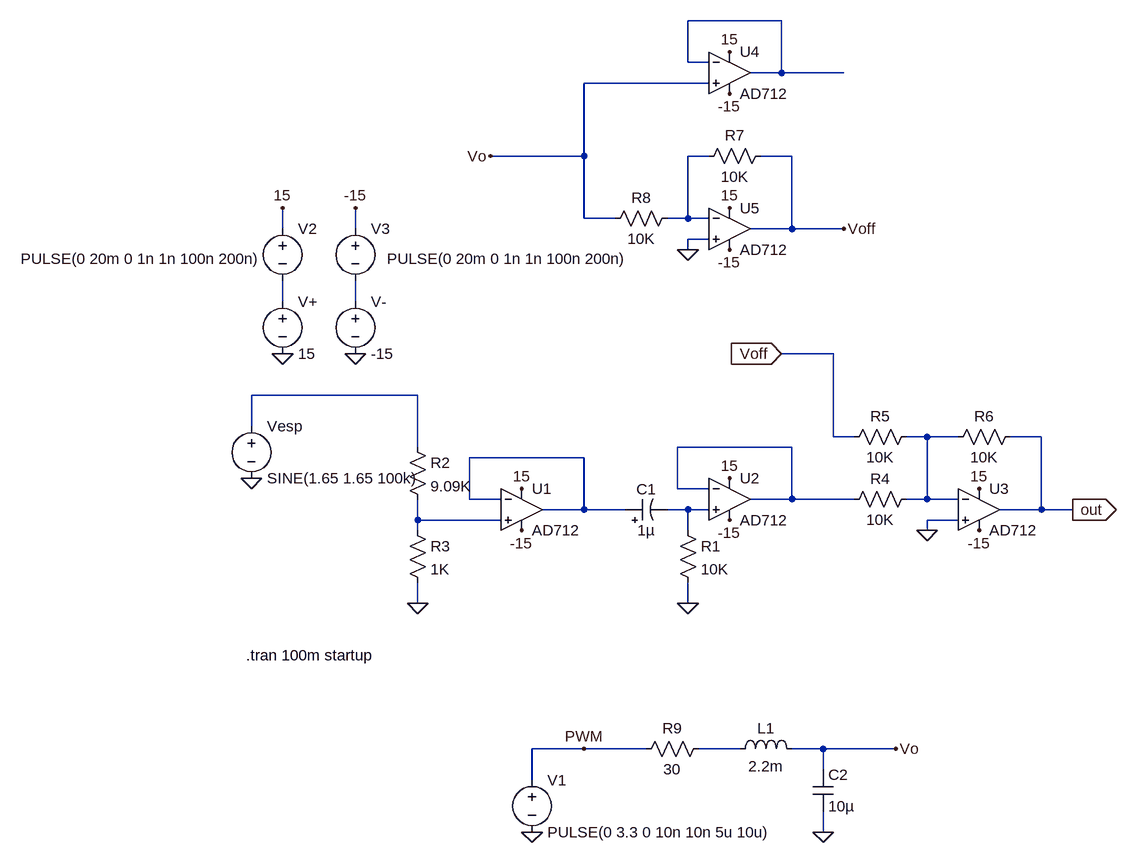
[diagram p0: schematic other.asc]
other.asc, the LTspice schematic file:
Version 4.1
SHEET 1 880 864
WIRE -368 -592 -512 -592
WIRE -512 -528 -512 -592
WIRE -480 -528 -512 -528
WIRE -368 -512 -368 -592
WIRE -368 -512 -416 -512
WIRE -272 -512 -368 -512
WIRE -480 -496 -672 -496
WIRE -672 -384 -672 -496
WIRE -672 -384 -816 -384
WIRE -480 -384 -512 -384
WIRE -352 -384 -400 -384
WIRE -672 -288 -672 -384
WIRE -624 -288 -672 -288
WIRE -512 -288 -512 -384
WIRE -512 -288 -544 -288
WIRE -480 -288 -512 -288
WIRE -1136 -272 -1136 -304
WIRE -1024 -272 -1024 -304
WIRE -352 -272 -352 -384
WIRE -352 -272 -416 -272
WIRE -272 -272 -352 -272
WIRE -480 -256 -512 -256
WIRE -512 -240 -512 -256
WIRE -1136 -160 -1136 -192
WIRE -1024 -160 -1024 -192
WIRE -288 -80 -368 -80
WIRE -928 -16 -1184 -16
WIRE -1184 32 -1184 -16
WIRE -288 48 -288 -80
WIRE -256 48 -288 48
WIRE -144 48 -176 48
WIRE -96 48 -144 48
WIRE 32 48 -16 48
WIRE -928 64 -928 -16
WIRE -352 64 -528 64
WIRE -672 80 -848 80
WIRE -528 128 -528 64
WIRE -480 128 -528 128
WIRE -848 144 -848 80
WIRE -800 144 -848 144
WIRE -352 144 -352 64
WIRE -352 144 -416 144
WIRE -256 144 -352 144
WIRE -144 144 -144 48
WIRE -144 144 -176 144
WIRE -96 144 -144 144
WIRE -672 160 -672 80
WIRE -672 160 -736 160
WIRE -608 160 -672 160
WIRE -512 160 -544 160
WIRE -480 160 -512 160
WIRE 32 160 32 48
WIRE 32 160 -32 160
WIRE 80 160 32 160
WIRE -928 176 -928 144
WIRE -800 176 -928 176
WIRE -96 176 -144 176
WIRE -928 192 -928 176
WIRE -512 192 -512 160
WIRE -144 192 -144 176
WIRE -928 304 -928 272
WIRE -512 304 -512 272
WIRE -672 528 -752 528
WIRE -576 528 -672 528
WIRE -432 528 -496 528
WIRE -304 528 -352 528
WIRE -192 528 -304 528
WIRE -304 560 -304 528
WIRE -752 576 -752 528
WIRE -304 656 -304 624
FLAG -1136 -80 0
FLAG -1024 -80 0
FLAG -1136 -304 15
FLAG -1024 -304 -15
FLAG -928 304 0
FLAG -1184 112 0
FLAG -768 128 15
FLAG -768 192 -15
FLAG -512 304 0
FLAG -448 112 15
FLAG -448 176 -15
FLAG -64 128 15
FLAG -64 192 -15
FLAG -144 192 0
FLAG 80 160 out
IOPIN 80 160 Out
FLAG -368 -80 Voff
IOPIN -368 -80 In
FLAG -448 -480 -15
FLAG -448 -544 15
FLAG -448 -240 -15
FLAG -448 -304 15
FLAG -512 -240 0
FLAG -272 -272 Voff
FLAG -752 656 0
FLAG -672 528 PWM
FLAG -304 656 0
FLAG -192 528 Vo
FLAG -816 -384 Vo
SYMBOL OpAmps\\AD712 -768 96 R0
SYMATTR InstName U1
SYMBOL OpAmps\\AD712 -448 80 R0
SYMATTR InstName U2
SYMBOL voltage -1136 -176 R0
SYMATTR InstName V+
SYMATTR Value 15
SYMBOL voltage -1024 -176 R0
SYMATTR InstName V-
SYMATTR Value -15
SYMBOL res -944 48 R0
SYMATTR InstName R2
SYMATTR Value 9.09K
SYMATTR SpiceLine tol=1 pwr=0.1
SYMBOL res -944 176 R0
SYMATTR InstName R3
SYMATTR Value 1K
SYMATTR SpiceLine tol=1 pwr=0.1
SYMBOL voltage -1184 16 R0
WINDOW 123 0 0 Left 0
WINDOW 39 0 0 Left 0
SYMATTR InstName Vesp
SYMATTR Value SINE(1.65 1.65 100k)
SYMBOL polcap -608 176 R270
WINDOW 0 32 32 VTop 2
WINDOW 3 0 32 VBottom 2
SYMATTR InstName C1
SYMATTR Value 1µ
SYMATTR SpiceLine Rser=8 Lser=30n
SYMBOL res -528 176 R0
SYMATTR InstName R1
SYMATTR Value 10K
SYMATTR SpiceLine tol=1 pwr=0.1
SYMBOL OpAmps\\AD712 -64 96 R0
SYMATTR InstName U3
SYMBOL res -160 128 R90
WINDOW 0 0 56 VBottom 2
WINDOW 3 32 56 VTop 2
SYMATTR InstName R4
SYMATTR Value 10K
SYMATTR SpiceLine tol=1 pwr=0.1
SYMBOL res -160 32 R90
WINDOW 0 0 56 VBottom 2
WINDOW 3 32 56 VTop 2
SYMATTR InstName R5
SYMATTR Value 10K
SYMATTR SpiceLine tol=1 pwr=0.1
SYMBOL res 0 32 R90
WINDOW 0 0 56 VBottom 2
WINDOW 3 32 56 VTop 2
SYMATTR InstName R6
SYMATTR Value 10K
SYMATTR SpiceLine tol=1 pwr=0.1
SYMBOL OpAmps\\AD712 -448 -576 R0
SYMATTR InstName U4
SYMBOL OpAmps\\AD712 -448 -336 R0
SYMATTR InstName U5
SYMBOL res -384 -400 R90
WINDOW 0 0 56 VBottom 2
WINDOW 3 32 56 VTop 2
SYMATTR InstName R7
SYMATTR Value 10K
SYMATTR SpiceLine tol=1 pwr=0.1
SYMBOL res -528 -304 R90
WINDOW 0 0 56 VBottom 2
WINDOW 3 32 56 VTop 2
SYMATTR InstName R8
SYMATTR Value 10K
SYMATTR SpiceLine tol=1 pwr=0.1
SYMBOL voltage -752 560 R0
WINDOW 123 0 0 Left 0
WINDOW 39 0 0 Left 0
SYMATTR InstName V1
SYMATTR Value PULSE(0 3.3 0 10n 10n 5u 10u)
SYMBOL res -480 512 R90
WINDOW 0 0 56 VBottom 2
WINDOW 3 32 56 VTop 2
SYMATTR InstName R9
SYMATTR Value 30
SYMBOL cap -320 560 R0
SYMATTR InstName C2
SYMATTR Value 10µ
SYMBOL ind -448 544 R270
WINDOW 0 32 56 VTop 2
WINDOW 3 5 56 VBottom 2
SYMATTR InstName L1
SYMATTR Value 2.2m
SYMATTR SpiceLine Rser=1m
SYMBOL voltage -1136 -288 R0
WINDOW 3 -403 62 Left 2
WINDOW 123 0 0 Left 0
WINDOW 39 0 0 Left 0
SYMATTR InstName V2
SYMATTR Value PULSE(0 20m 0 1n 1n 100n 200n)
SYMBOL voltage -1024 -288 R0
WINDOW 3 49 62 Left 2
WINDOW 123 0 0 Left 0
WINDOW 39 0 0 Left 0
SYMATTR InstName V3
SYMATTR Value PULSE(0 20m 0 1n 1n 100n 200n)
TEXT -1192 384 Left 2 !.tran 100m startup

The netlist it stands for:
* other.asc
X§U1 N010 N008 15 -15 N008 AD712  ; pins In+ In- V+ V- OUT
X§U2 N009 N007 15 -15 N007 AD712  ; pins In+ In- V+ V- OUT
V+ N003 0 15
V- N004 0 -15
R2 N005 N010 9.09K tol=1 pwr=0.1
R3 N010 0 1K tol=1 pwr=0.1
Vesp N005 0 SINE(1.65 1.65 100k)
C1 N008 N009 1µ Rser=8 Lser=30n
R1 N009 0 10K tol=1 pwr=0.1
X§U3 0 N006 15 -15 out AD712  ; pins In+ In- V+ V- OUT
R4 N006 N007 10K tol=1 pwr=0.1
R5 N006 Voff 10K tol=1 pwr=0.1
R6 out N006 10K tol=1 pwr=0.1
X§U4 Vo N001 15 -15 N001 AD712  ; pins In+ In- V+ V- OUT
X§U5 0 N002 15 -15 Voff AD712  ; pins In+ In- V+ V- OUT
R7 Voff N002 10K tol=1 pwr=0.1
R8 N002 Vo 10K tol=1 pwr=0.1
V1 PWM 0 PULSE(0 3.3 0 10n 10n 5u 10u)
R9 N011 PWM 30
C2 Vo 0 10µ
L1 N011 Vo 2.2m Rser=1m
V2 15 N003 PULSE(0 20m 0 1n 1n 100n 200n)
V3 -15 N004 PULSE(0 20m 0 1n 1n 100n 200n)
.tran 100m startup
.backanno
.end